# Altium project Gimbal.PrjPcb
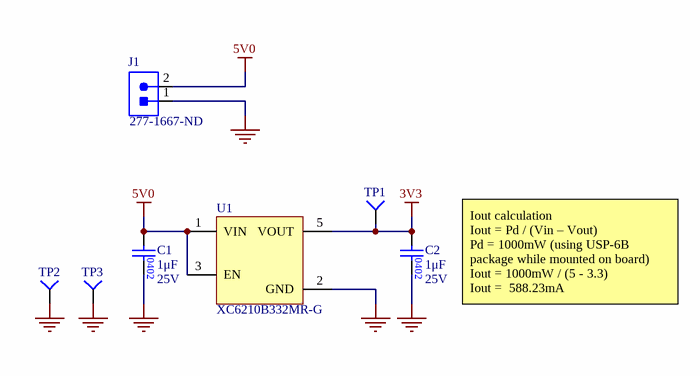
[diagram p0: SH1 - POWER.SchDoc]
3 sheets, 31 parts. Net scope: flat (ports and power ports of the same name join across sheets).
Sheets:
  SH1 - POWER.SchDoc
  SH2 - MICROCONTROLLER.SchDoc
  SH3 - LEVEL SHIFTER.SchDoc

## Sheet SH1 - POWER.SchDoc: POWER
size 431 x 279 mm; Engineer: Taylor McNabb; Revision: 2; SheetNumber: 1; SheetTotal: 3

### Parts
C1  value 1μF  Voltage: 25V  [CAP0402]  (hidden comment: CAP_1uF_25V_0402)
C2  value 1μF  Voltage: 25V  [CAP0402]  (hidden comment: CAP_1uF_25V_0402)
J1  Supplier Part Number 1: 277-1667-ND  [1935161]  (hidden comment: CON_2POS_SCREW_TERM)
TP1  TESTPOINT_SMD_LOOP  [S1751-46R]  (value not drawn)
TP2  TESTPOINT_SMD_LOOP  [S1751-46R]  (value not drawn)
TP3  TESTPOINT_SMD_LOOP  [S1751-46R]  (value not drawn)
U1  Manufacturer Part Number 1: XC6210B332MR-G  [SOT95P285X140-5N]  (hidden comment: LDO_3.3V_700mA)

### Nets
3V3: C2.1 TP1.1(=value) U1.5(VOUT)
5V0: C1.1 J1.2 U1.1(VIN) U1.3(EN)
GND: C1.2 C2.2 J1.1 TP2.1(=value) TP3.1(=value) U1.2(GND)

### Notes on the sheet
- (near C2) Iout calculation
  Iout = Pd / (Vin – Vout)
  Pd = 1000mW (using USP-6B package while mounted on board)
  Iout = 1000mW / (5 - 3.3)
  Iout =  588.23mA
- University of Waterloo Robotics Team
- 200 University Ave W
- REV
- PROJECT
- Waterloo, Ontario, Canada
- N2L 3G1
- DOCUMENT
- ENGINEER
- REVIEWER
- MODIFIED
- SHEET
- OF

### Library data of the parts
C1 C2 = CAP_1uF_25V_0402: CAP CER 1UF 25V X5R 0402; Manufacturer 1: TDK Corporation; Manufacturer Part Number 1: C1005X5R1E105K050BE; Supplier 1: Digi-Key; Supplier Part Number 1: 445-175215-1-ND; Package: 0402
J1 = CON_2POS_SCREW_TERM: TERM BLK 2POS SIDE ENTRY 5MM; Manufacturer 1: Phoenix Contact; Package/Footprint: SMD; Supplier 1: Digi-Key; Mounting Type: TH; Manufacturer Part Number 1: 1935161
TP1-TP3 = TESTPOINT_SMD_LOOP: PC TEST POINT SMD; Manufacturer 1: Harwin; Supplier 1: Digi-Key; Manufacturer Part Number 1: S1751-46R; Supplier Part Number 1: 952-1478-1-ND; Mounting Type: SMD; Package/Footprint: SMD
U1 = LDO_3.3V_700mA: IC REG LINEAR 3.3V 700MA SOT25; Manufacturer 1: Diodes Incorporated; Input Voltage (Max): 6V; Voltage Dropout (Max): 0.075V; Package/Footprint: SOT-25; Output Voltage (Fixed): 3.3V; Output Current: 700mA; Operating Temperature: -40°C - 85°C; Mounting Type: SMD; Supplier 1: Digi-Key; Supplier Part Number 1: 893-1075-1-ND

## Sheet SH2 - MICROCONTROLLER.SchDoc: MICROCONTROLLER
size 431 x 279 mm; Engineer: Taylor McNabb; Revision: 2; SheetNumber: 2; SheetTotal: 3
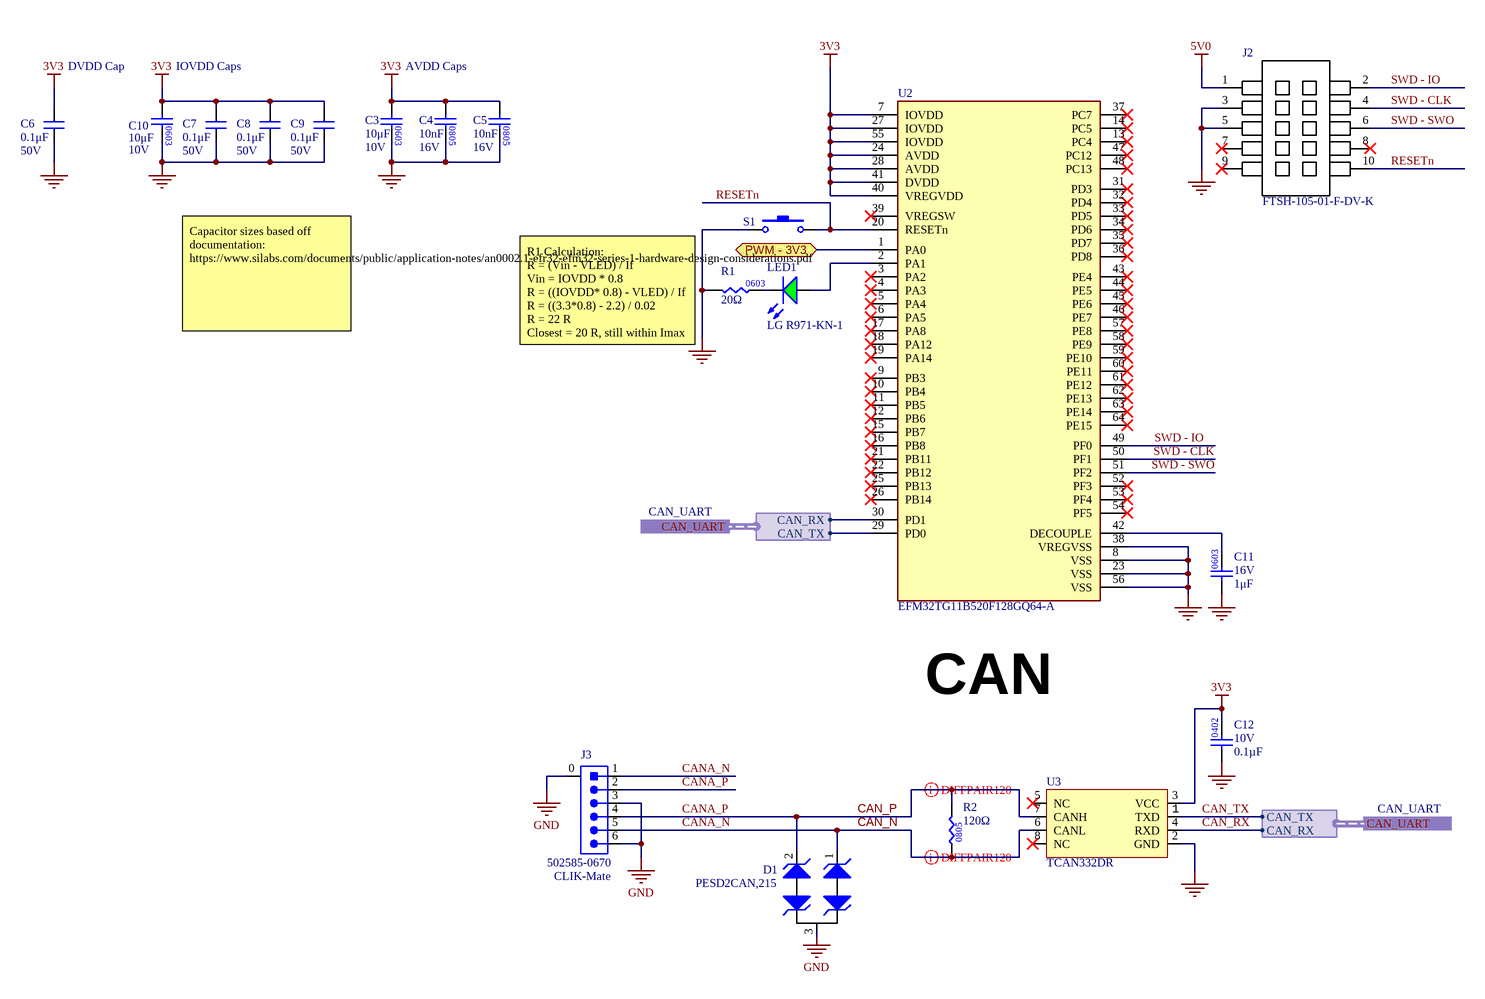
[diagram p1: SH2 - MICROCONTROLLER.SchDoc]

### Parts
C3  value 10μF  Voltage Rating: 10V  [CAP0603]  (hidden comment: CAP_10uF_10V_0603)
C4  value 10nF  Voltage Rating: 16V  [CAP2012]  (hidden comment: CAP_10nF_16V_0805)
C5  value 10nF  Voltage Rating: 16V  [CAP2012]  (hidden comment: CAP_10nF_16V_0805)
C6  value 0.1μF  Voltage Rating: 50V  [CAP0603]  (hidden comment: CAP_0.1uF_50V_0603)
C7  value 0.1μF  Voltage Rating: 50V  [CAP0603]  (hidden comment: CAP_0.1uF_50V_0603)
C8  value 0.1μF  Voltage Rating: 50V  [CAP0603]  (hidden comment: CAP_0.1uF_50V_0603)
C9  value 0.1μF  Voltage Rating: 50V  [CAP0603]  (hidden comment: CAP_0.1uF_50V_0603)
C10  value 10μF  Voltage Rating: 10V  [CAP0603]  (hidden comment: CAP_10uF_10V_0603)
C11  value 1μF  Voltage Rating: 16V  [CAP0603]  (hidden comment: CAP_1uF_16V_0603)
C12  value 0.1µF  Voltage Rating: 10V  [CAP0402]  (hidden comment: CAP_0.1uF_10V_0402)
D1  Manufacturer Part Number 1: PESD2CAN,215  [TVS_DIODE_CAN]  (hidden comment: TVS_DIODE_CAN)
J2  Manufacturer Part Number 1: FTSH-105-01-F-DV-K  [FTSH-105-01-F-DV-K-P-TR]  (hidden comment: CON_PROGRAMMING)
J3  Family: CLIK-Mate  Manufactor Number: 502585-0670  [MOLEX-5025850670]  (hidden comment: CON_6M_SM_RA_1.5mm)
LED1  Manufacturer Part Number 1: LG R971-KN-1  [LED_0805_GREEN]  (hidden comment: LED_GREEN)
R1  value 20Ω  [RES0603]  (hidden comment: RES_20Ω_0603_5%)
R2  value 120Ω  [RES0805]  (hidden comment: RES_120Ω_0805_1%)
S1  SW_SPST_NO  [B3U-1000P]  (value not drawn)
U2  EFM32TG11B520F128GQ64-A
U3  IC_CAN_TRANSCEIVER_1MBPS  [TCAN332DR]  (value not drawn)

### Ports
CAN_UART (harness CAN_UART), PWM - 3V3 (bidir)

### Harnesses
CAN_UART: CAN_RX, CAN_TX

### Nets
3V3: C3.1 C4.1 C5.1 C6.2 C7.2 C8.2 C9.2 C10.1 C12.2 U2.7(IOVDD) U2.24(AVDD) U2.27(IOVDD) U2.28(AVDD) U2.40(VREGVDD) U2.41(DVDD) U2.55(IOVDD) U3.3(VCC)
5V0: J2.1
GND: C3.2 C4.2 C5.2 C6.1 C7.1 C8.1 C9.1 C10.2 C11.1 C12.1 D1.3 J2.3 J2.5 J3.0 J3.3 J3.6 R1.1 S1.1 U2.8(VSS) U2.23(VSS) U2.38(VREGVSS) U2.56(VSS) U3.2(GND)
CAN_N: D1.1 J3.1 J3.5 R2.1 U3.6(CANL)  [also labelled CANA_N]
CAN_P: D1.2 J3.2 J3.4 R2.2 U3.7(CANH)  [also labelled CANA_P]
CAN_RX: U2.30(PD1) U3.4(RXD) ; port CAN_UART.CAN_RX
CAN_TX: U2.29(PD0) U3.1(TXD) ; port CAN_UART.CAN_TX
RESETn: J2.10 S1.2 U2.20(RESETn)
SWD - CLK: J2.4 U2.50(PF1)
SWD - IO: J2.2 U2.49(PF0)
SWD - SWO: J2.6 U2.51(PF2)
NetC11_2: C11.2 U2.42(DECOUPLE)
NetLED1_1: LED1.1(A) U2.2(PA1)
NetLED1_2: LED1.2(K) R1.2
NetTP4_1: U2.1(PA0) ; port PWM - 3V3

Not connected (* = marked no-connect by the designer): J2 7* 8* 9*; U2 3(PA2)* 4(PA3)* 5(PA4)* 6(PA5)* 9(PB3)* 10(PB4)* 11(PB5)* 12(PB6)* 13(PC4)* 14(PC5)* 15(PB7)* 16(PB8)* 17(PA8)* 18(PA12)* 19(PA14)* 21(PB11)* 22(PB12)* 25(PB13)* 26(PB14)* 31(PD3)* 32(PD4)* 33(PD5)* 34(PD6)* 35(PD7)* 36(PD8)* 37(PC7)* 39(VREGSW)* 43(PE4)* 44(PE5)* 45(PE6)* 46(PE7)* 47(PC12)* 48(PC13)* 52(PF3)* 53(PF4)* 54(PF5)* 57(PE8)* 58(PE9)* 59(PE10)* 60(PE11)* 61(PE12)* 62(PE13)* 63(PE14)* 64(PE15)*; U3 5(NC)* 8(NC)*

### Layout directives
differential pair: CAN_N, CAN_P

### Notes on the sheet
- DVDD Cap
- IOVDD Caps
- AVDD Caps
- Capacitor sizes based off documentation:
  https://www.silabs.com/documents/public/application-notes/an0002.1-efr32-efm32-series-1-hardware-design-considerations.pdf
- (near R1) R1 Calculation:
  R = (Vin - VLED) / If
  Vin = IOVDD * 0.8
  R = ((IOVDD* 0.8) - VLED) / If
  R = ((3.3*0.8) - 2.2) / 0.02
  R = 22 R
  Closest = 20 R, still within Imax
- CAN
- University of Waterloo Robotics Team
- 200 University Ave W
- REV
- PROJECT
- Waterloo, Ontario, Canada
- N2L 3G1
- DOCUMENT
- ENGINEER
- REVIEWER
- MODIFIED
- SHEET
- OF
- (in symbol CAP_10nF_16V_0805) 0805
- (in symbol CAP_10uF_10V_0603) 0603

### Library data of the parts
C3 C10 = CAP_10uF_10V_0603: CAP CER 10UF 10V X5R 0603; Manufacturer Part Number 1: CC0603MRX5R6BB106; Manufacturer 1: Yageo; Supplier Part Number 1: 311-1817-1-ND; Supplier 1: Digi-Key; Dielectric: X5R
C4 C5 = CAP_10nF_16V_0805: CAP CER 10000PF 16V X7R 0805; Manufacturer 1: Yageo; Manufacturer Part Number 1: AC0805KRX7R7BB103; Supplier 1: Digi-Key; Supplier Part Number 1: 311-3161-1-ND
C6-C9 = CAP_0.1uF_50V_0603: CAP CER 0.1UF 50V X7R 0603; Manufacturer Part Number 1: CC0603KRX7R9BB104; Manufacturer 1: Yageo; Package/Footprint: 0603; Temperature Coefficient: X7R; Supplier Part Number 1: 311-1344-1-ND; Supplier 1: Digi-Key; Dielectric: X7R; Mounting Type: SMD
C11 = CAP_1uF_16V_0603: CAP CER 1UF 16V Y5V 0603; Manufacturer 1: Yageo; Manufacturer Part Number 1: CC0603ZRY5V7BB105; Supplier Part Number 1: 311-1372-1-ND; Supplier 1: Digi-Key; Mounting Type: SMD; Package: 0603; Dielectric: Y5V
C12 = CAP_0.1uF_10V_0402: CAP CER 0.1UF 10V X7R 0402; Manufacturer 1: Murata Electronics; Manufacturer Part Number 1: GRM155R71A104KA01D; Package/Footprint: 0402; Supplier 1: Digi-Key; Supplier Part Number 1: 490-6321-1-ND
D1 = TVS_DIODE_CAN: TVS DIODE 24V 41V SOT323-3; Manufacturer 1: Nexperia USA Inc.; Supplier Part Number 1: 1727-3891-1-ND; Supplier 1: Digi-Key; Package/Footprint: SOT323-3; Mounting Type: Surface Mount
J2 = CON_PROGRAMMING: CONN HEADER SMD 10POS 1.27MM; Manufacturer 1: Samtec; Supplier 1: Digi-Key; Mounting Type: SMD; Pitch: 1.27mm; Supplier Part Number 1: SAM8796-ND
J3 = CON_6M_SM_RA_1.5mm: CONN HEADER SMD RIGHT ANGLE 1.5 MM PITCH; Manufacturer: Molex; Supplier 1: Digi-Key; Supplier Part Number 1: WM12832CT-ND; Package/Footprint: SMD; Mounting Type: SMD
LED1 = LED_GREEN: LED GREEN DIFFUSED 0805 SMD; Manufacturer 1: OSRAM; Forward Voltage Drop: 2.2V; Package/Footprint: 0805; Supplier Part Number 1: 475-1410-1-ND; Supplier 1: Digi-Key; Mounting Type: SMD
R1 = RES_20Ω_0603_5%: RES 20 OHM 5% 1/10W 0603; Manufacturer 1: Yageo; Manufacturer Part Number 1: RC0603JR-0720RL; Supplier Part Number 1: 311-20GRCT-ND; Supplier 1: Digi-Key; Mounting Type: SMD; Package: 0603
R2 = RES_120Ω_0805_1%: RES 120 OHM 1% 1/8W 0805; Manufacturer 1: Vishay; Manufacturer Part Number 1: CRCW0805120RFKEA; Package/Footprint: 0805; Supplier Part Number 1: 541-120CCT-ND; Supplier 1: Digi-Key; LCSC Part #: C17437; Mounting Type: SMD
S1 = SW_SPST_NO: SMT 3.0 X 2.6 MM TACT SWITCH WIT; Manufacturer Part Number 1: 435151014824; Manufacturer 1: Würth Elektronik; Mounting Type: SMD; Supplier 1: Digi-Key; Supplier Part Number 1: 732-435151014824CT-ND
U2 = EFM32TG11B520F128GQ64-A: EFM32 Tiny Gecko Series 1 MCUs 32-bit ARM® Cortex®-M0+; Manufacturer: Silicon Labs; Manufacturer Part Number: EFM32TG11B520F128GQ64-AR; Interface: I2C,SPI,IrDA,UART,USART; Peripherals: Brown-out Detect/Reset,POR,PWM,WDT,DMA,LCD; Memory Type: FLASH; Core Architecture: ARM; Frequency: 48MHz; Number of I/Os: 50; Memory Size: 128KB; Oscillator Type: Internal; Supplier 1: Digi-Key; Supplier Part Number 1: EFM32TG11B520F128GQ64-AR-ND; RoHS: Yes; Pricing 1: 1000=2.05659 (USD); Case/Package: TQFP; Min Operating Temperature: -40°C; Max Operating Temperature: 85°C; Packaging: Tape and Reel; ComponentLink1URL: https://www.silabs.com/documents/public/data-sheets/efm32tg11-datasheet.pdf?src-supplier=Digi-Key; ComponentLink1Description: https://www.silabs.com/documents/public/data-sheets/efm32tg11-datasheet.pdf?src-supplier=Digi-Key; ComponentLink2Description: Capacitor Sizing Guide; ComponentLink2URL: https://www.silabs.com/documents/public/application-notes/an0002.1-efr32-efm32-series-1-hardware-design-considerations.pdf
U3 = IC_CAN_TRANSCEIVER_1MBPS: IC TXRX CAN 1MBPS 8SOIC; Manufacturer 1: Texas Instruments; Voltage - Supply: 3V ~ 3.6V; Package/Footprint: 8-SOIC; Receiver Hysteresis: 120 mV; ComponentLink1Description: New link; ComponentLink1URL: *; Supplier 1: Digi-Key; Supplier Part Number 1: 296-43711-1-ND; Data Rate: 1Mbps; Operating Temperature: -40°C ~ 125°C; Mounting Type: Surface Mount; Manufacturer Part Number 1: TCAN332DR

## Sheet SH3 - LEVEL SHIFTER.SchDoc: LEVEL SHIFTER
size 431 x 279 mm; Engineer: Taylor McNabb; Revision: 2; SheetNumber: 3; SheetTotal: 3
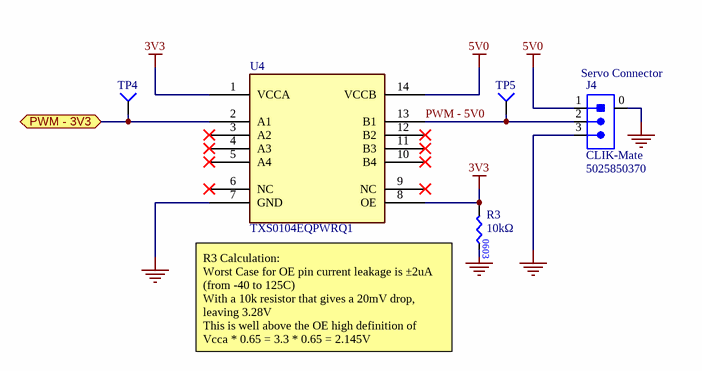
[diagram p2: SH3 - LEVEL SHIFTER.SchDoc]

### Parts
J4  Family: CLIK-Mate  Manufacturer Part Number 1: 5025850370  [MOLEX-5025850370]  (hidden comment: CON_3M_SM_RA)
R3  value 10kΩ  [RES0603]  (hidden comment: RES_10kΩ_0603_5%)
TP4  TESTPOINT_SMD_LOOP  [S1751-46R]  (value not drawn)
TP5  TESTPOINT_SMD_LOOP  [S1751-46R]  (value not drawn)
U4  IC_LVL_SHIFTER_4_CH  [TXS0104EQPWRQ1]  (value not drawn)

### Ports
PWM - 3V3 (bidir)

### Nets
3V3: R3.1 U4.1(VCCA) U4.8(OE)
5V0: J4.1 U4.14(VCCB)
GND: J4.0 J4.3 R3.2 U4.7(GND)
PWM - 5V0: J4.2 TP5.1(=value) U4.13(B1)
NetTP4_1: TP4.1(=value) U4.2(A1) ; port PWM - 3V3

Not connected (* = marked no-connect by the designer): U4 3(A2)* 4(A3)* 5(A4)* 6(NC)* 9(NC)* 10(B4)* 11(B3)* 12(B2)*

### Notes on the sheet
- (near J4) Servo Connector
- R3 Calculation:
  Worst Case for OE pin current leakage is ±2uA (from -40 to 125C)
  With a 10k resistor that gives a 20mV drop, leaving 3.28V
  This is well above the OE high definition of
  Vcca * 0.65 = 3.3 * 0.65 = 2.145V
- University of Waterloo Robotics Team
- 200 University Ave W
- REV
- PROJECT
- Waterloo, Ontario, Canada
- N2L 3G1
- DOCUMENT
- ENGINEER
- REVIEWER
- MODIFIED
- SHEET
- OF

### Library data of the parts
J4 = CON_3M_SM_RA: CONN RCPT 3POS 0.059 TIN SMD R/A; Manufacturer 1: Molex; Current Rating: 2A; Voltage Rating: 100V; Pitch: 1.5mm; Supplier 1: Digi-Key; Mounting Type: SMD; Package/Footprint: SMD; Orientation: Right Angle; Supplier Part Number 1: WM12831CT-ND
R3 = RES_10kΩ_0603_5%: RES 10K OHM 5% 1/10W 0603; Manufacturer 1: Yageo; Manufacturer Part Number 1: RC0603JR-0710KL; Supplier Part Number 1: 311-10KGRCT-ND; Supplier 1: Digi-Key; Mounting Type: SMD; Package: 0603
TP4 TP5 = TESTPOINT_SMD_LOOP: as TP1 on sheet SH1 - POWER; Supplier 1: Digi-Key; Manufacturer Part Number 1: S1751-46R; Supplier Part Number 1: 952-1478-1-ND; Mounting Type: SMD; Package/Footprint: SMD
U4 = IC_LVL_SHIFTER_4_CH: IC BIDIRECTIONAL LEVEL SHIFTER 4 CHANNEL 14TSSOP; Manufacturer 1: Texas Instruments; Data Rate: 24Mbps; Package/Footprint: 14-TSSOP; VCCA Voltage: 1.65 V ~ 3.6 V; VCCB Voltage: 2.3 V ~ 5.5 V; VCCA Max: 3V6 MAX; VCCB Max: 5V5 MAX; Supplier 1: Digi-Key; Mounting Type: SMD; Supplier Part Number 1: 296-41034-1-ND; Manufacturer Part Number 1: TXS0104EQPWRQ1

## Nets that join several sheets
3V3: SH1 - POWER (C2.1 TP1.1 U1.5), SH2 - MICROCONTROLLER (17 pins), SH3 - LEVEL SHIFTER (R3.1 U4.1 U4.8)
5V0: SH1 - POWER (C1.1 J1.2 U1.1 U1.3), SH2 - MICROCONTROLLER (J2.1), SH3 - LEVEL SHIFTER (J4.1 U4.14)
GND: SH1 - POWER (6 pins), SH2 - MICROCONTROLLER (23 pins), SH3 - LEVEL SHIFTER (J4.0 J4.3 R3.2 U4.7)
NetTP4_1: SH2 - MICROCONTROLLER (U2.1), SH3 - LEVEL SHIFTER (TP4.1 U4.2)